# Altium schematic sheet usb_serial.SchDoc: USB to Serial
size Letter; Organization: OSURC Mars Rover; DocumentNumber: 1; Revision: 1; SheetNumber: 3; SheetTotal: 7
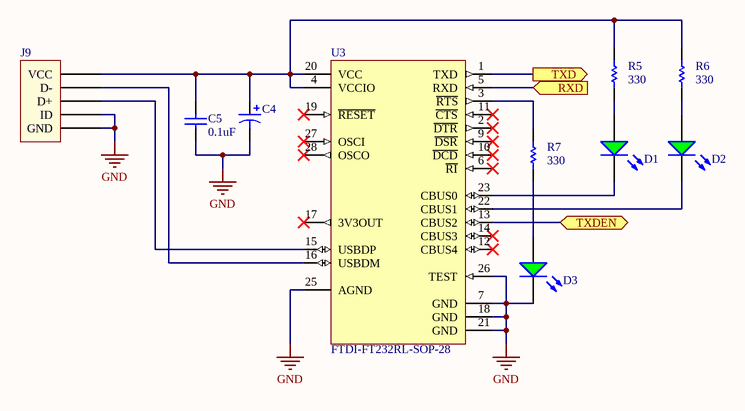
[diagram p0: usb_serial.SchDoc]

## Parts
C4  Cap Pol2  [PCB-egxxoj2f8mz0uec15l92-1]  (value not drawn)
C5  0.1uF  [CAPC1608X90X35NL20T15]
D1  SYM-ec4c254b98bc338b-2  [PCB-9uwk2xd6chnjs8ehct7l-1]  (value not drawn)
D2  SYM-ec4c254b98bc338b-2  [PCB-9uwk2xd6chnjs8ehct7l-1]  (value not drawn)
D3  SYM-ec4c254b98bc338b-2  [PCB-9uwk2xd6chnjs8ehct7l-1]  (value not drawn)
J9  Samtec SPM-05-S-B-RA-PF  [PCB-zq8ywneimcsz1qyvw1ex-1]  (value not drawn)
R5  330  [PCB-1852941-1]
R6  330  [PCB-1852941-1]
R7  330  [PCB-1852941-1]
U3  FTDI-FT232RL-SOP-28  [SOP65P780X200-28N]

## Ports
RXD (in), TXD (out), TXDEN (bidir)

## Nets
GND: C4.2 C5.1 D3.C J9.4(ID) J9.5(GND) U3.7(GND) U3.18(GND) U3.21(GND) U3.25(AGND) U3.26(TEST)
RXD: U3.5(RXD) ; port RXD
TXD: U3.1(TXD) ; port TXD
TXDEN: U3.13(CBUS2) ; port TXDEN
NetC4_1: C4.1 C5.2 J9.1(VCC) R5.2 R6.2 U3.4(VCCIO) U3.20(VCC)
NetD1_A: D1.A R5.1
NetD1_C: D1.C U3.23(CBUS0)
NetD2_A: D2.A R6.1
NetD2_C: D2.C U3.22(CBUS1)
NetD3_A: D3.A R7.1
NetJ9_2: J9.2(D-) U3.16(USBDM)
NetJ9_3: J9.3(D+) U3.15(USBDP)
NetR7_2: R7.2 U3.3(~{RTS})

Not connected (* = marked no-connect by the designer): U3 2(~{DTR})* 6(~{RI})* 9(~{DSR})* 10(~{DCD})* 11(~{CTS})* 12(CBUS4)* 14(CBUS3)* 17(3V3OUT)* 19(~{RESET})* 27(OSCI)* 28(OSCO)*

## Notes on the sheet
- Title
- Size:
- Date:
- Letter
- Number:
- Time:
- Revision:
- Sheet
- of
- File:

## Library data of the parts
C4 = CMP-7994653-3: CAPACITOR TANT, 1UF, 16V, SMD; Capacitance: 1µF; Capacitance Tolerance: ± 20%; Voltage Rating: 16VDC; ESR: 10ohm; No....; Manufacturer Part Number: F981C105MMA; Lead-Free Status: Lead Free; Voltage Rating (DC): 16.0 V; Mounting Style: Surface Mount; Number of Pins: 2; Size-Height: 800 µm; OctopartID: 5dd3957d11448214; Capacitance Tolerance: ±20%; RoHS: Compliant; Packaging: Cut Tape (CT); Octopart URL: http://octopart.com/f981c105mma-avx-27552241
C5 = CMP-120344-2: CAP CER 0.1UF 50V 10% X7R 0603; Capacitance: 1e-07 F; Lead-Free Status: Lead Free; Voltage Rating (DC): 50.0 V; Capacitance Tolerance: ±10%; Dielectric Characteristic: X7R; Octopart Url: https://octopart.com/gcj188r71h104ka12d-murata-20842003; OctopartID: aa306204894575f7; RoHS: Compliant
D1-D3 = CMP-ec4c254b98bc338b-4: Led; 0603 Smt Led, Green, Alingap, Water Clear Lens, 140 Deg Viewing Angle; Case/Package (SI): 1608; Lead-Free Status: Lead Free; Size-Height: 700 µm; Octopart URL: http://octopart.com/598-8070-107f-dialight-872854; Size-Length: 1.60 mm; Number of Pins: 2
J9 = CMP-d3c01be030ed0c07-2: Conn USB M 5 POS Solder RA Thru-Hole 5 Terminal 1 Port; Gender: Male; Packaging: Bulk; Mounting Style: Through Hole, Solder; OctopartID: d3c01be030ed0c07; Octopart URL: http://octopart.com/spm-05-s-b-ra-pf-samtec-19580491; Manufacturer Part Number: SPM-05-S-B-RA-PF
R5-R7 = CMP-1852941-3: RESISTOR, RC21 0603 330R; Manufacturer Part Number: RC0603JR-07330RL; Voltage Rating (DC): 50.0 V; Resistance Tolerance: ±5%; Power Rating: 0.1 W; Lead-Free Status: Lead Free; Size-Width: 0.0008 m; RoHS: Compliant; Octopart Url: https://octopart.com/rc0603jr-07330rl-yageo-39803615; Size-Height: 0.00045 m; Size-Length: 0.0016 m; OctopartID: 0b82c0d7743bd445; Mounting Style: Surface Mount; REACH SVHC Compliance: No SVHC; Case/Package: 0603; Number of Pins: 2; Resistance: 330
U3 = CMP-1159378-16: SMD IC Interface; USB to UART; Speed 300b-3Mbaud; VCC 1.8V-5.25V; Supply Voltage (DC): 1.80 V (min); Lead-Free Status: Lead Free; Data Rate: 3.00 Mbps; Supply Current: 15.0 mA; OctopartID: bcc675ec4d616301; Manufacturer Part Number: FT232RL; RoHS: Compliant; Number of Pins: 28; Octopart URL: http://octopart.com/ft232rl-ftdi-2151617; Packaging: Tube; Mounting Style: Surface Mount; REACH SVHC Compliance: No SVHC